# EAGLE design miniPCI_CAN_bus_controller (EAGLE 9.6.2)
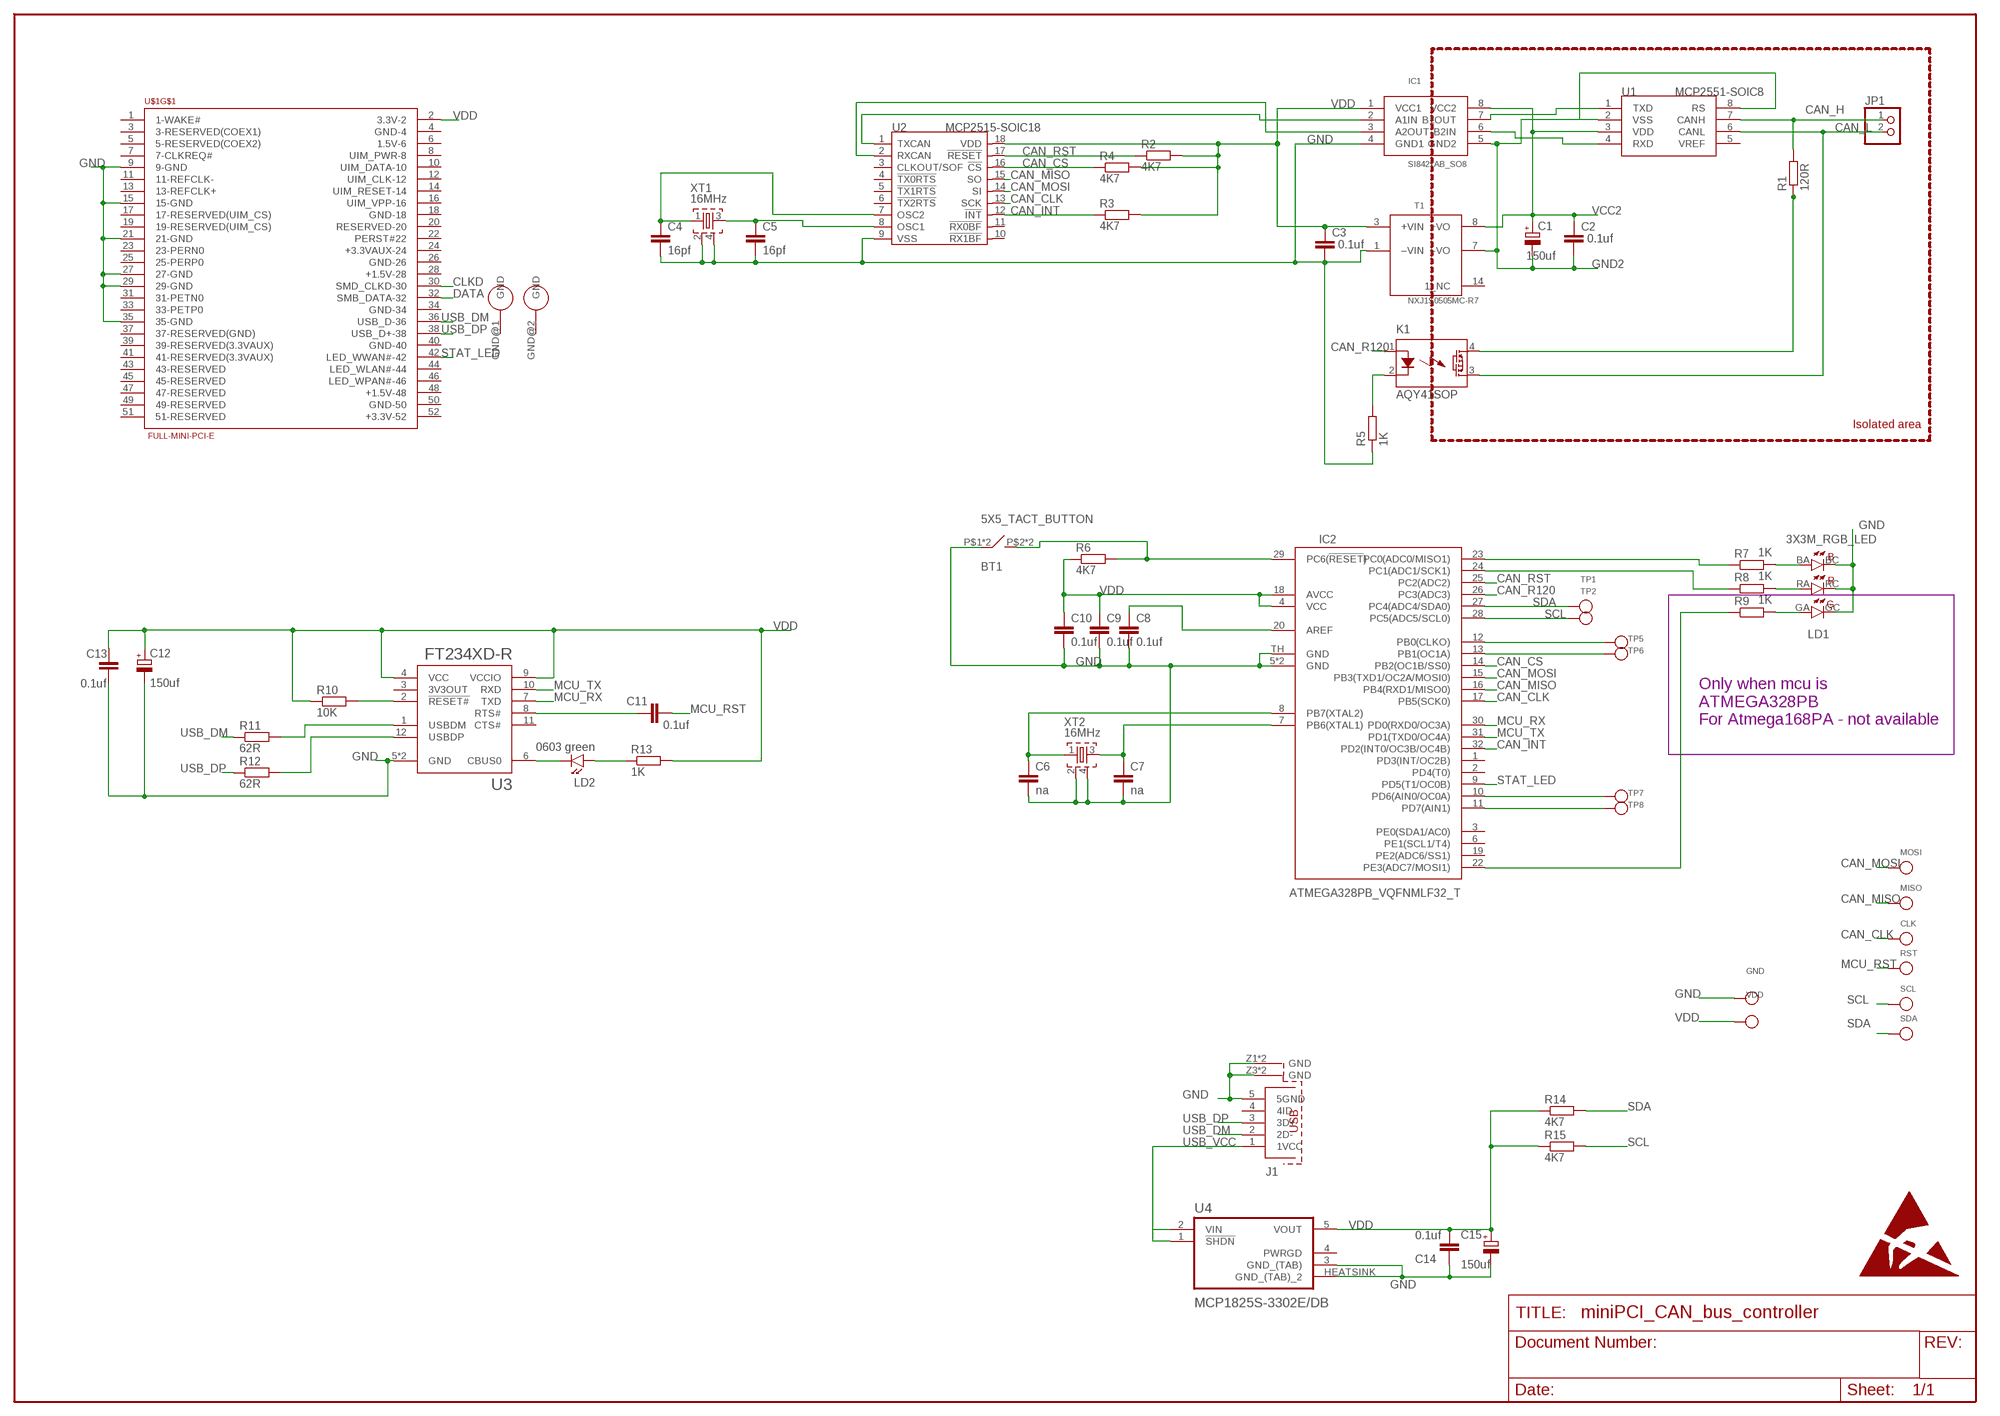
[diagram p0: schematic, sheet 1]

## Parts
BT1  5X5_TACT_BUTTON  5X5_TACT_BUTTONCYCLONE  [5X5MM_SMD_CY]
C1  150uf  TANTAL_150UF_3528  [KA-3528ASYC]
C2  0.1uf  SMD_C0603  [0603]
C3  0.1uf  SMD_C0603  [0603]
C4  16pf  SMD_C0603  [0603]
C5  16pf  SMD_C0603  [0603]
C6  na  SMD_C0603  [0603]
C7  na  SMD_C0603  [0603]
C8  0.1uf  SMD_C0603  [0603]
C9  0.1uf  SMD_C0603  [0603]
C10  0.1uf  SMD_C0603  [0603]
C11  0.1uf  SMD_C0603  [0603]
C12  150uf  TANTAL_150UF_3528  [KA-3528ASYC]
C13  0.1uf  SMD_C0603  [0603]
C14  0.1uf  SMD_C0603  [0603]
C15  150uf  TANTAL_150UF_3528  [KA-3528ASYC]
CLK  TEST_POINT_D2MM  [TP]
GND  TEST_POINT_D2MM  [TP]
IC1  SI8421AB_SO8  [SO8]
IC2  ATMEGA328PB_VQFNMLF32_T  [MLF32-TH]
J1  MINI_USB_TYP_B_@  [65100516121]
JP1  PINHD-1X2  [1X02]
K1  AQY41SOP  [SOP04]
LD1  3X3M_RGB_LED  [3X3MRGB_LED]
LD2  0603 green  LED0603  [0603_P]
MISO  TEST_POINT_D2MM  [TP]
MOSI  TEST_POINT_D2MM  [TP]
R1  120R  SMD_R0603  [0603]
R2  4K7  SMD_R0603  [0603]
R3  4K7  SMD_R0603  [0603]
R4  4K7  SMD_R0603  [0603]
R5  1K  SMD_R0603  [0603]
R6  4K7  SMD_R0603  [0603]
R7  1K  SMD_R0603  [0603]
R8  1K  SMD_R0603  [0603]
R9  1K  SMD_R0603  [0603]
R10  10K  SMD_R0603  [0603]
R11  62R  SMD_R0603  [0603]
R12  62R  SMD_R0603  [0603]
R13  1K  SMD_R0603  [0603]
R14  4K7  SMD_R0603  [0603]
R15  4K7  SMD_R0603  [0603]
RST  TEST_POINT_D2MM  [TP]
SCL  TEST_POINT_D2MM  [TP]
SDA  TEST_POINT_D2MM  [TP]
T1  NXJ1S0505MC-R7  [NXJ1SXXXXMC]
TP1  TEST_POINT_D2MM  [TP]
TP2  TEST_POINT_D2MM  [TP]
TP5  TEST_POINT_D2MM  [TP]
TP6  TEST_POINT_D2MM  [TP]
TP7  TEST_POINT_D2MM  [TP]
TP8  TEST_POINT_D2MM  [TP]
U1  MCP2551-SOIC8  [SO8]
U2  MCP2515-SOIC18  [SO18L]
U3  FT234XD-R  [IC_FT234XD-R]
U4  MCP1825S-3302E/DB  [SOT230P700X180-4N]
U$1  FULL-MINI-PCI-E  [FULL-MINI-PCI-E]
VDD  TEST_POINT_D2MM  [TP]
XT1  16MHz  QUARTZ_ZQ  [QUARTZ_3X3MM]
XT2  16MHz  QUARTZ_ZQ  [QUARTZ_3X3MM]

## Nets
CAN_CLK: CLK.P$1 IC2.17(PB5(SCK0)) U2.13(SCK)
CAN_CS: IC2.14(PB2(OC1B/SS0)) R4.1 U2.16(!CS)
CAN_H: JP1.1 R1.2 U1.7(CANH)
CAN_INT: IC2.32(PD2(INT0/OC3B/OC4B)) R3.1 U2.12(!INT)
CAN_L: JP1.2 K1.3(DS2) U1.6(CANL)
CAN_MISO: IC2.16(PB4(RXD1/MISO0)) MISO.P$1 U2.15(SO)
CAN_MOSI: IC2.15(PB3(TXD1/OC2A/MOSI0)) MOSI.P$1 U2.14(SI)
CAN_R120: IC2.26(PC3(ADC3)) K1.1(A)
CAN_RST: IC2.25(PC2(ADC2)) R2.1 U2.17(!RESET)
CLKD: U$1.30(SMD_CLKD-30)
DATA: U$1.32(SMB_DATA-32)
GND: BT1.P$1 BT1.P$4 C3.2 C4.2 C5.2 C6.2 C7.2 C8.2 C9.2 C10.2 C12.M(-) C13.1 C14.1 C15.M(-) GND.P$1 IC1.4(GND1) IC2.5(GND) IC2.21(GND) IC2.TH(GND) J1.5(5GND) J1.Z1(GND) J1.Z2(GND) J1.Z3(GND) J1.Z4(GND) LD1.BC LD1.GC LD1.RC R5.1 T1.1(–VIN) U2.9(VSS) U3.5(GND) U3.13(GND) U4.3(GND_(TAB)) U4.HEATSINK(GND_(TAB)_2) U$1.9(9-GND) U$1.15(15-GND) U$1.21(21-GND) U$1.27(27-GND) U$1.29(29-GND) U$1.35(35-GND) XT1.2 XT1.4 XT2.2 XT2.4
GND2: C1.M(-) C2.2 IC1.5(GND2) T1.7(–VO) U1.2(VSS) U1.8(RS)
MCU_RST: BT1.P$2 BT1.P$3 C11.2 IC2.29(PC6(!RESET!)) R6.2 RST.P$1
MCU_RX: IC2.30(PD0(RXD0/OC3A)) U3.7(TXD)
MCU_TX: IC2.31(PD1(TXD0/OC4A)) U3.10(RXD)
N$1: R11.2 U3.1(USBDM)
N$2: K1.4(DS1) R1.1
N$3: IC1.2(A1IN) U2.1(TXCAN)
N$4: IC1.7(B1OUT) U1.1(TXD)
N$5: IC1.6(B2IN) U1.4(RXD)
N$6: IC1.3(A2OUT) U2.2(RXCAN)
N$7: C8.1 IC2.20(AREF)
N$8: LD2.1(K) U3.6(CBUS0)
N$9: LD2.2(A) R13.1
N$10: C6.1 IC2.8(PB7(XTAL2)) XT2.1
N$11: C4.1 U2.7(OSC2) XT1.1
N$12: C5.1 U2.8(OSC1) XT1.3
N$13: K1.2(K) R5.2
N$14: C7.1 IC2.7(PB6(XTAL1)) XT2.3
N$15: LD1.BA R7.2
N$16: LD1.RA R8.2
N$17: LD1.GA R9.2
N$18: R12.2 U3.12(USBDP)
N$19: IC2.23(PC0(ADC0/MISO1)) R7.1
N$20: IC2.24(PC1(ADC1/SCK1)) R8.1
N$21: IC2.22(PE3(ADC7/MOSI1)) R9.1
N$22: IC2.10(PD6(AIN0/OC0A)) TP7.P$1
N$23: IC2.11(PD7(AIN1)) TP8.P$1
N$24: C11.1 U3.8(RTS#)
N$25: IC2.13(PB1(OC1A)) TP6.P$1
N$26: IC2.12(PB0(CLKO)) TP5.P$1
N$27: R10.2 U3.2(!RESET#)
SCL: IC2.28(PC5(ADC5/SCL0)) R15.2 SCL.P$1 TP2.P$1
SDA: IC2.27(PC4(ADC4/SDA0)) R14.2 SDA.P$1 TP1.P$1
STAT_LED: IC2.9(PD5(T1/OC0B)) U$1.42(LED_WWAN#-42)
USB_DM: J1.2(2D-) R11.1 U$1.36(USB_D-36)
USB_DP: J1.3(3D+) R12.1 U$1.38(USB_D+-38)
USB_VCC: J1.1(1VCC) U4.1(!SHDN) U4.2(VIN)
VCC2: C1.P(+) C2.1 IC1.8(VCC2) T1.8(+VO) U1.3(VDD)
VDD: C3.1 C9.1 C10.1 C12.P(+) C13.2 C14.2 C15.P(+) IC1.1(VCC1) IC2.4(VCC) IC2.18(AVCC) R2.2 R3.2 R4.2 R6.1 R10.1 R13.2 R14.1 R15.1 T1.3(+VIN) U2.18(VDD) U3.4(VCC) U3.9(VCCIO) U4.5(VOUT) U$1.2(3.3V-2) VDD.P$1
Unconnected: IC2.1(PD3(INT/OC2B)) IC2.2(PD4(T0)) IC2.3(PE0(SDA1/AC0)) IC2.6(PE1(SCL1/T4)) IC2.19(PE2(ADC6/SS1)) J1.4(4ID) T1.14(1_NC) U1.5(VREF) U2.3(CLKOUT/SOF) U2.4(!TX0RTS) U2.5(!TX1RTS) U2.6(!TX2RTS) U2.10(!RX1BF) U2.11(!RX0BF) U3.3(3V3OUT) U3.11(CTS#) U4.4(PWRGD) U$1.1(1-WAKE#) U$1.3(3-RESERVED(COEX1)) U$1.4(GND-4) U$1.5(5-RESERVED(COEX2)) U$1.6(1.5V-6) U$1.7(7-CLKREQ#) U$1.8(UIM_PWR-8) U$1.10(UIM_DATA-10) U$1.11(11-REFCLK-) U$1.12(UIM_CLK-12) U$1.13(13-REFCLK+) U$1.14(UIM_RESET-14) U$1.16(UIM_VPP-16) U$1.17(17-RESERVED(UIM_CS)) U$1.18(GND-18) U$1.19(19-RESERVED(UIM_CS)) U$1.20(RESERVED-20) U$1.22(PERST#22) U$1.23(23-PERN0) U$1.24(+3.3VAUX-24) U$1.25(25-PERP0) U$1.26(GND-26) U$1.28(+1.5V-28) U$1.31(31-PETN0) U$1.33(33-PETP0) U$1.34(GND-34) U$1.37(37-RESERVED(GND)) U$1.39(39-RESERVED(3.3VAUX)) U$1.40(GND-40) U$1.41(41-RESERVED(3.3VAUX)) U$1.43(43-RESERVED) U$1.44(LED_WLAN#-44) U$1.45(45-RESERVED) U$1.46(LED_WPAN#-46) U$1.47(47-RESERVED) U$1.48(+1.5V-48) U$1.49(49-RESERVED) U$1.50(GND-50) U$1.51(51-RESERVED) U$1.52(+3.3V-52)

## Notes on the sheet
- Isolated area
- Only when mcu is
  ATMEGA328PB
  For Atmega168PA - not available

## Power pins joined to a net without a drawn wire
GND: U$1.GND@1(GND) U$1.GND@2(GND)

## Library data of the parts
BT1 = passive_components:5X5_TACT_BUTTON
C1 C12 C15 = passive_components:TANTAL_150UF_3528
C2-C11 C13 C14 = passive_components:SMD_C
CLK GND MISO MOSI RST SCL SDA TP1 TP2 TP5-TP8 VDD = passive_components:TEST_POINT_D2MM
IC1 = my_IC:SI8421AB_SO8
IC2 = my_IC:ATMEGA328PB_VQFN
J1 = passive_components:MINI_USB_TYP_B_@
JP1 = pinhead:PINHD-1X2: PIN HEADER
K1 = relays:AQY*: PhotoMOS Relay NAiS Source: http://www.panasonic-electric-works.com/catalogues/downloads/photomos/ds_x615_en_aqz10_20.pdf; OC_FARNELL: unknown; OC_NEWARK: unknown
LD1 = passive_components:3X3M_RGB_LED
LD2 = passive_components:LED
R1-R15 = passive_components:SMD_R
T1 = Tracopower - TSM 0505S:NXJ1S0505MC-R7: № Mouser:580-NXJ1S0505MC-R7 № произв.: NXJ1S0505MC-R7 Произв.:Murata Power Solutions Номер клиента: Номер клиента Описание: Преобразователи постоянного тока в постоянный с изоляцией 1W 5Vin 5Vout 200mA SM
U1 = my_IC:MCP2551: High-Speed CAN Transceiver http://ww1.microchip.com/downloads/en/devicedoc/21667f.pdf
U2 = my_IC:MCP2515: Stand-Alone CAN Controller With SPI Interface
U3 = my_IC:FT234XD-R: USB Bridge, USB to UART USB 2.0 UART Interface 12-DFN (3x3); AVAILABILITY: Unavailable; DESCRIPTION: USB Bridge, USB to UART USB 2.0 UART Interface 12-DFN (3x3); MF: FTDI,; MP: FT234XD-R; PACKAGE: DFN-12 FTDI; PRICE: None
U4 = my_IC:MCP1825S-3302E/DB; AVAILABILITY: Unavailable; DESCRIPTION: Linear Voltage Regulator IC 1 Output 500mA SOT-223-3; MF: Microchip; MP: MCP1825S-3302E/DB; PACKAGE: SOT-223 Microchip; PRICE: None
U$1 = mini-pci-e:FULL-MINI-PCI-E
XT1 XT2 = passive_components:QUARTZ_ZQ

## Board
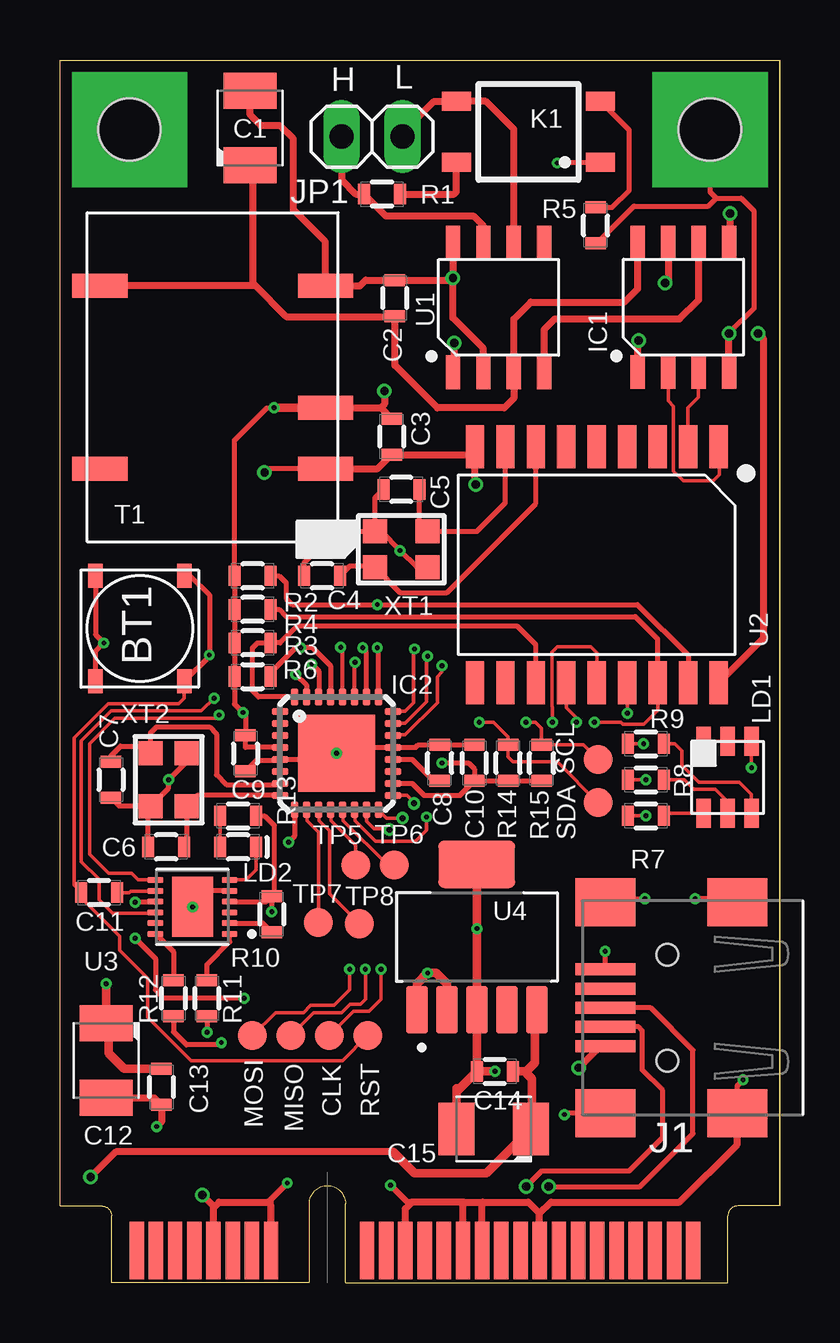
[diagram p1: board, top side]
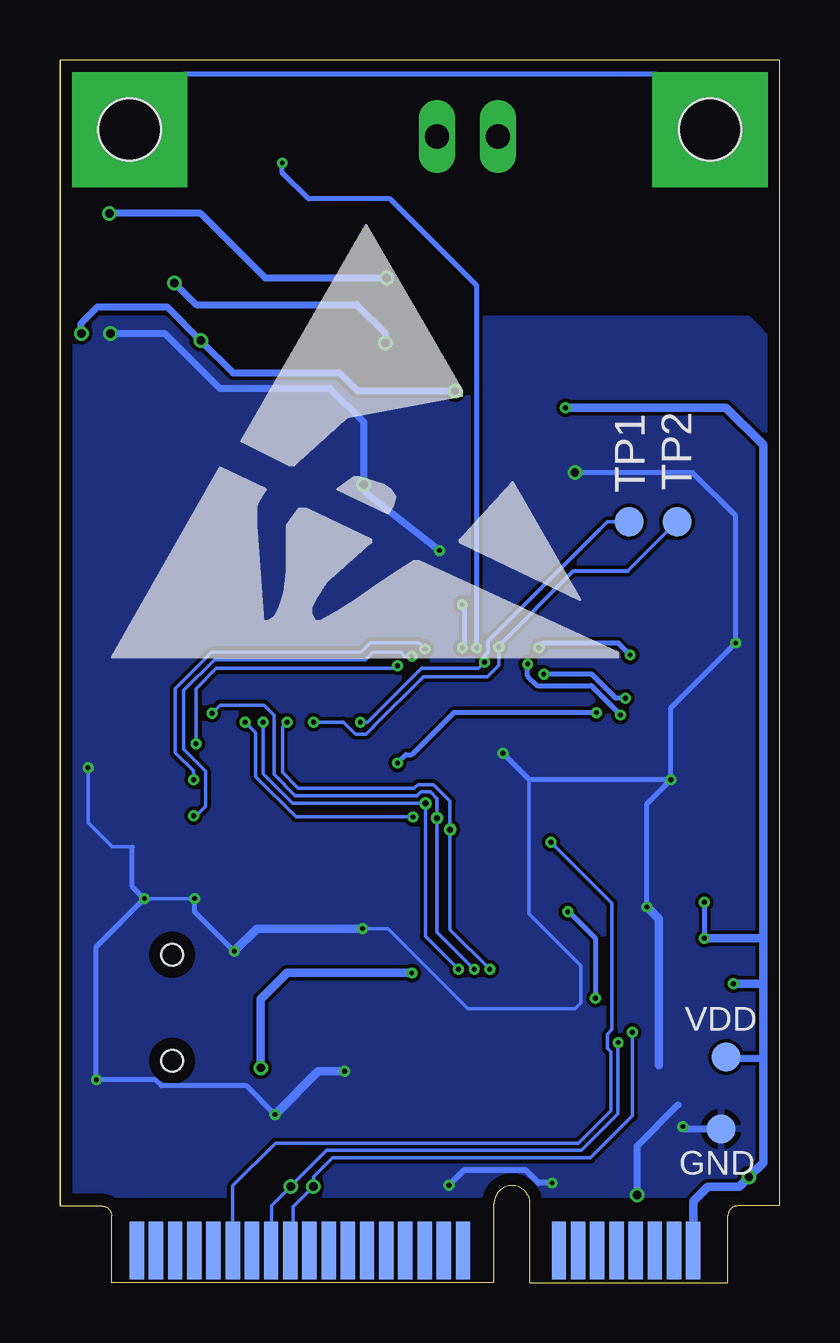
[diagram p2: board, bottom side, seen from below]

Size 30 x 50.95 mm. Coordinates in mm from the lower left corner, seen from the top.
Copper layers (1*16): Top 0.035mm / dielectric 1.5mm / Bottom 0.035mm
Design rules "default *": minimum track width 6mil, minimum drill 0.2mm, track to track 6mil, track to pad 6mil, pad to pad 6mil, via to via 6mil, smd to smd 6mil, copper to edge 20mil, drill to drill 6mil, minimum pad ring 5mil, minimum via ring 5mil, stop-mask expansion 4mil, vias tented up to drill 20mil, thermal gap 10mil

### Footprints (pad centres in the part's own frame; a part is rotated, then mirrored left to right if it is on the bottom)
5X5MM_SMD_CY = smd 1 x 0.6: P$1 -2.2,1.85; P$2 -2.2,-1.85; P$3 2.2,-1.85; P$4 2.2,1.85
KA-3528ASYC = smd 1.5 x 2.2: M -1.55,0; P 1.55,0
0603 = smd 0.85 x 0.5: 1 0,0.75; 2 0,-0.75
TP = smd 1.2 x 1.2: P$1 0,0
SO8 = smd 0.6 x 1.4: 1 -1.905,-2.7; 2 -0.635,-2.7; 3 0.635,-2.7; 4 1.905,-2.7; 5 1.905,2.7; 6 0.635,2.7; 7 -0.635,2.7; 8 -1.905,2.7
MLF32-TH = smd 0.7 x 0.3: 1 -2.35,1.75; 2 -2.35,1.25; 3 -2.35,0.75; 4 -2.35,0.25; 5 -2.35,-0.25; 6 -2.35,-0.75; 7 -2.35,-1.25; 8 -2.35,-1.75; 17 2.35,-1.75; 18 2.35,-1.25; 19 2.35,-0.75; 20 2.35,-0.25; 21 2.35,0.25; 22 2.35,0.75; 23 2.35,1.25; 24 2.35,1.75 | smd 0.3 x 0.7: 9 -1.75,-2.35; 10 -1.25,-2.35; 11 -0.75,-2.35; 12 -0.25,-2.35; 13 0.25,-2.35; 14 0.75,-2.35; 15 1.25,-2.35; 16 1.75,-2.35; 25 1.75,2.35; 26 1.25,2.35; 27 0.75,2.35; 28 0.25,2.35; 29 -0.25,2.35; 30 -0.75,2.35; 31 -1.25,2.35; 32 -1.75,2.35 | smd 3.2 x 3.2: TH 0,0
65100516121 = smd 0.5 x 2.5: 1 -1.6,2.6; 2 -0.8,2.6; 3 0,2.6; 4 0.8,2.6; 5 1.6,2.6 | smd 2 x 2.5: Z1 -4.4,2.6; Z2 4.4,2.6; Z3 4.4,-2.9; Z4 -4.4,-2.9 | hole 0.9: -2.2,0; 2.2,0
1X02 = drill 1.016 long: 1 -1.27,0; 2 1.27,0
SOP04 = smd 0.8 x 1.2: 1 -1.27,-3; 2 1.27,-3; 3 1.27,3; 4 -1.27,3
3X3MRGB_LED = smd 0.6 x 1.2: BA -1,-1.5; BC -1,1.5; GA 1,-1.5; GC 1,1.5; RA 0,-1.5; RC 0,1.5
0603_P = smd 0.85 x 0.5: 1 0,0.75; 2 0,-0.75
NXJ1SXXXXMC = smd 1 x 2.3: 1 -3.81,-4.7; 3 -1.27,-4.7; 7 3.81,-4.7; 8 3.81,4.7; 14 -3.81,4.7
SO18L = smd 0.762 x 1.778: 1 -5.08,-4.915; 2 -3.81,-4.915; 3 -2.54,-4.915; 4 -1.27,-4.915; 5 0,-4.915; 6 1.27,-4.915; 7 2.54,-4.915; 8 3.81,-4.915; 9 5.08,-4.915; 10 5.08,4.915; 11 3.81,4.915; 12 2.54,4.915; 13 1.27,4.915; 14 0,4.915; 15 -1.27,4.915; 16 -2.54,4.915; 17 -3.81,4.915; 18 -5.08,4.915
IC_FT234XD-R = smd 0.65 x 0.25: 1 -1.55,1.125; 2 -1.55,0.675; 3 -1.55,0.225; 4 -1.55,-0.225; 5 -1.55,-0.675; 6 -1.55,-1.125; 7 1.55,-1.125; 8 1.55,-0.675; 9 1.55,-0.225; 10 1.55,0.225; 11 1.55,0.675; 12 1.55,1.125 | smd 1.7 x 2.5: 13 0,0
SOT230P700X180-4N = smd 1.97 x 0.89: 1 -3.025,2.5; 2 -3.025,1.25; 3 -3.025,0; 4 -3.025,-1.25; 5 -3.025,-2.5 | smd 1.97 x 3.19: HEATSINK 3.025,0
FULL-MINI-PCI-E = smd 0.6 x 2.4: 1 -7.95,1.45; 3 -7.15,1.45; 5 -6.35,1.45; 7 -5.55,1.45; 9 -4.75,1.45; 11 -3.95,1.45; 13 -3.15,1.45; 15 -2.35,1.45; 17 1.65,1.45; 19 2.45,1.45; 21 3.25,1.45; 23 4.05,1.45; 25 4.85,1.45; 27 5.65,1.45; 29 6.45,1.45; 31 7.25,1.45; 33 8.05,1.45; 35 8.85,1.45; 37 9.65,1.45; 39 10.45,1.45; 41 11.25,1.45; 43 12.05,1.45; 45 12.85,1.45; 47 13.65,1.45; 49 14.45,1.45; 51 15.25,1.45 | smd 0.6 x 2.4 bottom: 2 -7.55,1.45; 4 -6.75,1.45; 6 -5.95,1.45; 8 -5.15,1.45; 10 -4.35,1.45; 12 -3.55,1.45; 14 -2.75,1.45; 16 -1.95,1.45; 18 2.05,1.45; 20 2.85,1.45; 22 3.65,1.45; 24 4.45,1.45; 26 5.25,1.45; 28 6.05,1.45; 30 6.85,1.45; 32 7.65,1.45; 34 8.45,1.45; 36 9.25,1.45; 38 10.05,1.45; 40 10.85,1.45; 42 11.65,1.45; 44 12.45,1.45; 46 13.25,1.45; 48 14.05,1.45; 50 14.85,1.45; 52 15.65,1.45 | drill 2.6 pad 4.8 square: GND@1 -8.25,48.15; GND@2 15.95,48.15 | hole 2.6: -8.25,48.15; 15.95,48.15
QUARTZ_3X3MM = smd 1 x 1: 1 -0.75,1.1; 2 0.75,1.1; 3 0.75,-1.1; 4 -0.75,-1.1

### Placement (x,y rotation side)
BT1  3.33,27.26 90 top
C1  7.93,48.12 270 top
C2  13.96,41.03 180 top
C3  13.83,35.26 0 top
C4  10.93,29.46 270 top
C5  14.23,33.06 270 top
C6  4.43,18.16 270 top
C7  2.13,20.96 0 top
C8  15.83,21.66 180 top
C9  7.73,22.06 0 top
C10  17.28,21.66 180 top
C11  1.63,16.26 270 top
C12  1.93,9.26 90 top
C13  4.23,8.16 180 top
C14  18.13,8.81 90 top
C15  18.08,6.41 0 top
CLK  11.23,10.31 0 top
GND  2.43,6.41 0 bottom
IC1  25.99,40.65 0 top
IC2  11.53,22.06 0 top
J1  25.33,11.46 90 top
JP1  13.01,47.76 0 top
K1  19.53,47.96 90 top
LD1  27.83,21.06 0 top
LD2  7.43,18.16 270 top
MISO  9.63,10.31 0 top
MOSI  8.03,10.31 0 top
R1  13.43,45.36 270 top
R2  8.03,29.46 270 top
R3  8.03,26.66 270 top
R4  8.03,28.06 270 top
R5  22.33,44.06 180 top
R6  8.03,25.26 90 top
R7  24.43,19.46 90 top
R8  24.43,20.96 90 top
R9  24.43,22.46 90 top
R10  8.83,15.36 0 top
R11  6.13,11.86 180 top
R12  4.73,11.86 180 top
R13  7.43,19.46 90 top
R14  18.68,21.66 180 top
R15  20.08,21.66 180 top
RST  12.83,10.31 0 top
SCL  22.43,21.81 180 top
SDA  22.43,20.01 270 top
T1  6.37,37.73 90 top
TP1  6.28,31.71 0 bottom
TP2  4.28,31.71 0 bottom
TP5  12.33,17.41 0 top
TP6  13.93,17.41 0 top
TP7  10.78,15.01 0 top
TP8  12.48,14.96 0 top
U1  18.29,40.64 0 top
U2  22.38,29.92 180 top
U3  5.53,15.66 180 top
U4  17.38,14.41 90 top
U$1  11.15,-0.1 0 top
U$2  [ESD]  28.03,25.86 0 bottom
VDD  2.23,9.41 0 bottom
XT1  14.23,30.56 90 top
XT2  4.53,20.96 180 top

### Tracks (layer width: path | path; a pad name or v marks a point on that pad's centre or on a via)
CAN_CLK  (via drill 0.2 pad 0.35, 0.25)
  Top 0.152: IC2.17 14.47,20.31 14.75,20.02 v14.75,19.97
  Top 0.153: U2.13 21.11,23.96 21.53,23.54 v21.53,23.36 | CLK.P$1 12.23,11.31 12.88,11.31 13.38,11.81 v13.38,13.06
  Bottom 0.153: v21.53,23.36 21.53,21.21 20.29,19.97 v14.75,19.97 14.75,19.57 14.76,19.57 14.76,14.44 v13.38,13.06
CAN_CS  (via drill 0.2 pad 0.35)
  Top 0.153: IC2.14 12.3,19.69 12.3,19.26 13.16,18.4 14.82,18.4 15.28,18.86 v15.28,19.41 | 24.93,25 U2.16 | U2.16 | v22.28,23.36 23.38,23.36 23.47,23.28 24.35,23.28 24.92,23.85 U2.16
  Top 0.2: U2.16 24.92,26.82 23.98,27.76 9.43,27.76 9.13,28.06 R4.1 8.83,28.01
  Bottom 0.153: v22.28,23.36 21.83,22.92 21.83,21.08 20.16,19.41 v15.28,19.41
CAN_H
  Top 0.3: JP1.1 11.74,45.95 12.33,45.36 R1.2 13.58,44.46 17.23,44.46 17.65,44.03 U1.7
CAN_INT
  Top 0.2: U2.12 19.84,26.6 19.08,27.36 9.87,27.36 9.18,26.66 R3.1 8.23,26.66 8.03,26.46 8.03,24.66 8.28,24.41 IC2.32
CAN_L
  Top 0.3: JP1.2 14.28,47.91 15.6,49.23 K1.3 17.76,49.23 18.92,48.06 U1.6
CAN_MISO  (via drill 0.2 pad 0.35, 0.25)
  Top 0.153: IC2.16 13.62,19.37 v14.28,19.37 | 10.03,10.71 MISO.P$1 10.58,11.26 11.75,11.26 12.1,11.61 12.53,11.61 12.73,11.81 v12.73,13.06 | v23.65,23.74 23.65,25.11
  Top 0.2: 23.65,25.74 23.65,25.11 U2.15
  Bottom 0.153: v23.65,23.74 23.32,24.07 21.49,24.07 21.07,23.65 21.07,21.19 20.19,20.3 15.11,20.3 14.95,20.45 14.56,20.45 14.27,20.17 14.27,19.77 14.28,19.77 v14.28,19.37 14.28,14.61 v12.73,13.06
CAN_MOSI  (via drill 0.2 pad 0.35, 0.25)
  Top 0.153: IC2.15 12.78,19.23 13.1,18.91 13.7,18.91 v13.73,18.89 | 8.03,10.76 MOSI.P$1 8.98,11.26 10.15,11.26 10.45,11.57 11.43,11.57 12.08,12.21 v12.08,13.06 | v20.53,23.36 20.53,23.99 20.5,24.02 20.5,26.28 20.73,26.51 22.13,26.51 22.38,26.26 U2.14
  Top 0.2: IC2.15 12.78,19.4
  Bottom 0.153: v20.53,23.36 20.72,23.17 20.72,21.27 20.07,20.61 15.23,20.61 15.08,20.76 14.43,20.76 13.73,20.06 v13.73,18.89 13.73,14.71 v12.08,13.06
CAN_R120  (via drill 0.2 pad 0.12)
  Top 0.2: IC2.26 12.78,26.23 12.75,26.26 12.75,26.33 v12.62,26.46 | v20.73,46.66 20.76,46.69 K1.1
  Bottom 0.2: v12.62,26.46 12.62,41.55 16.23,45.16 19.63,45.16 20.73,46.26 v20.73,46.66
CAN_RST  (via drill 0.2 pad 0.12)
  Top 0.2: R2.1 9.13,29.46 9.43,29.16 9.43,28.51 9.68,28.26 v13.23,28.26 24.08,28.26 26.19,26.15 U2.17 | IC2.25 13.28,26.41 v13.23,26.46
  Bottom 0.2: v13.23,28.26 13.13,28.16 13.13,26.56 v13.23,26.46
GND  (via drill 0.2, 0.2 pad 0.12, 0.2 pad 0.35, 0.35, 0.35 pad 0.12)
  Top 0.152: v28.83,21.46 LD1.GC LD1.RC LD1.BC
  Top 0.153: IC2.TH 12.73,22.06 12.98,22.31
  Top 0.2: C4.2 10.18,30.01 11.48,31.31 XT1.2 13.13,32.71 C5.2 | 13.38,31.31 v14.18,30.51 14.88,29.81 XT1.4 | R5.1 22.38,43.31 23.93,44.86 27.03,44.86 27.36,45.19 | 27.36,45.19 28.4,45.19 28.93,44.66 28.93,40.59 v27.89,39.56 | U$1.GND@2 27.1,45.45 27.36,45.19 | C7.2 2.48,19.86 XT2.2 | C6.2 3.68,19.76 XT2.2 | IC2.TH 11.28,21.81 IC2.5 9.13,21.76 8.18,21.76 C9.2 | 12.98,22.31 IC2.21 14.83,22.31 14.93,22.41 C8.2 C10.2 | XT2.4 5.28,21.71 v4.53,20.96 4.53,20.61 XT2.2 | T1.1 8.69,33.92 v8.53,33.76 | BT1.P$1 1.48,26.31 v1.83,26.66 1.48,27.01 BT1.P$4 | U3.5 6.25,16.34 6.23,16.36 U3.13 | 26.58,15.91 v26.48,16.01 28.08,16.01 J1.Z3 | J1.Z2 22.88,16.01 v24.38,16.01 | J1.Z4 28.23,8.21 v28.48,8.46 | J1.Z1 21.08,7.06 v21.03,7.01 | J1.5 v22.73,13.81
  Top 0.25: 8.8,3.23 8.8,3.48 v9.48,4.16 | 14.67,3.36 14.48,3.36 v13.78,4.06
  Top 0.3: IC1.4 v27.89,39.56 | v17.33,33.26 17.3,33.29 17.3,34.76 | 17.3,34.76 U2.9 | T1.1 13.24,33.92 C3.2 17.05,34.51 17.3,34.76 | XT1.2 13.38,31.31 | U$1.15 8.8,3.23 8.67,3.36 6.63,3.36 6.4,3.13 | U$1.21 14.4,3.09 14.67,3.36 16.83,3.36 | U$1.35 20,2.89 | 16.83,3.36 17.63,3.36 | 17.63,3.36 19.53,3.36 20,2.89 | U$1.29 17.6,3.33 17.63,3.36 | U$1.27 16.8,3.33 16.83,3.36 | 20,2.89 20.47,3.36 25.83,3.36 28.23,5.76 J1.Z4 | U$1.9 6.4,3.13 | 6.4,3.13 6.4,3.19 v5.93,3.66 | C12.M 3.93,7.71 C13.1 4.23,6.71 v4.03,6.51
  Top 0.35: U4.HEATSINK v17.38,14.76 U4.3 C14.1 | C15.M 16.53,7.96 | 16.53,7.96 C14.1 | 16.53,7.96 16.53,8.11 | v18.13,8.81 C14.1
  Bottom 0.152: v28.83,21.46 28.83,19.16 27.83,18.16 26.98,18.16
  Bottom 0.153: v26.48,16.01 v24.38,16.01 | v17.38,14.76 16.33,14.76 12.98,11.41 8.53,11.41 8.28,11.66 8.28,13.21 10.45,15.39 10.45,20.99
  Bottom 0.2: U$1.GND@1 5.21,50.36 24.79,50.36 U$1.GND@2 | v4.53,20.96 10.43,20.96 10.45,20.99 IC2.TH | v4.53,20.96 4.53,23.96 v1.83,26.66 1.83,31.96 3.63,33.76 v8.53,33.76 | U3.13 5.53,19.96 v4.53,20.96 | 24.43,16.06 v24.38,16.01 24.38,15.46 v22.73,13.81 | 26.98,18.16 26.98,16.51 v26.48,16.01 28.48,14.01 v28.48,8.46 26.03,8.46 25.77,8.2 22.22,8.2 v21.03,7.01
  Bottom 0.25: v9.48,4.16 10.05,4.16 10.57,4.68 13.16,4.68 v13.78,4.06
  Bottom 0.3: v27.89,39.56 25.63,39.56 23.33,37.26 18.73,37.26 17.33,35.86 v17.33,33.26 17.23,33.36 17.23,32.9 v14.18,30.51 | v5.93,3.66 5.93,5.71 C13.1 | 2.58,6.41 GND.P$1 3.93,6.41 v4.03,6.51
  Bottom 0.35: U3.13 5.03,15.16 5.03,9.06 | v17.38,14.76 21.78,14.76 v22.73,13.81 | v21.03,7.01 19.23,8.81 v18.13,8.81
  other vias: 11.53,22.06 5.53,15.66
  pour Bottom: 30.03,40.16 1.33,40.16 0.23,39.06 0.23,4.76 1.33,3.66 30.03,3.66
GND2  (via drill 0.35)
  Top 0.3: U1.2 17.65,38.94 16.38,40.2 v16.38,41.86 | U1.8 v16.38,41.86 | v27.93,44.56 27.93,43.39 IC1.5 | v16.38,41.86 16.3,41.78 C2.2 12.75,41.78 12.51,41.54 T1.7 11.07,43.37 9.73,44.71 9.73,47.66 9.18,48.21 8.38,48.21 7.93,48.66 C1.M
  Bottom 0.3: v16.38,41.86 21.43,41.86 24.13,44.56 v27.93,44.56
MCU_RST  (via drill 0.2 pad 0.12)
  Top 0.153: RST.P$1 11.78,9.26 5.46,9.26 3.65,11.07 3.65,12.69 2.48,13.86 2.48,14.45 1.05,15.87 1.05,16.09 C11.2 0.58,16.55 0.58,22.71 2.01,24.13 4.95,24.13 5.18,24.36 BT1.P$2
  Top 0.2: R6.2 8.78,25.41 9.83,26.46 v10.03,26.46 10.53,26.46 11.28,25.71 IC2.29 | BT1.P$2 6.23,26.11 v6.23,26.16 6.23,28.66 5.43,29.46 BT1.P$3
  Bottom 0.2: v6.23,26.16 6.73,26.66 9.88,26.66 10.03,26.51 v10.03,26.46
MCU_RX  (via drill 0.2 pad 0.12)
  Top 0.153: v6.63,23.66 6.49,23.52 2.29,23.52 1.23,22.46 1.23,17.86 2.03,17.06 2.98,17.06 3.25,16.79 U3.7
  Top 0.2: IC2.30 10.8,24.43 10.8,25.48 v10.5,25.78
  Bottom 0.2: v6.63,23.66 7.85,24.88 10.1,24.88 10.5,25.28 v10.5,25.78
MCU_TX  (via drill 0.2 pad 0.12)
  Top 0.153: v6.43,24.36 5.9,23.83 2.13,23.83 0.89,22.58 0.89,17.55 1.63,16.81 1.63,15.96 2.19,15.4 3.94,15.4 U3.10
  Top 0.2: v9.83,25.36 10.28,24.91 IC2.31
  Bottom 0.2: v6.43,24.36 6.83,24.36 7.83,25.36 v9.83,25.36
N$1
  Top 0.2: U3.1 7.08,14.21 6.13,13.26 R11.2
N$2
  Top 0.3: R1.1 16.43,45.36 16.53,45.46 K1.4
N$3
  Top 0.153: IC1.2 25.35,36.74 25.58,36.52 25.58,33.81 25.98,33.41 27.23,33.41 27.48,33.66 27.48,34.99 27.46,35.01
  Top 0.3: 27.46,35.43 27.46,35.01 U2.1
N$4  (via drill 0.35)
  Top 0.3: IC1.7 25.35,41.78 v25.23,41.66 | v16.43,39.16 16.43,37.98 U1.1
  Bottom 0.3: 24.93,41.36 v25.23,41.66 24.33,40.76 17.63,40.76 16.43,39.56 v16.43,39.16
N$5
  Top 0.3: U1.4 20.19,39.72 20.63,40.16 25.83,40.16 26.63,40.96 IC1.6
N$6
  Top 0.153: IC1.3 26.62,36.91 26.18,36.46 26.18,34.84 U2.2
N$7
  Top 0.2: IC2.20 14.68,21.81 15.58,20.91 C8.1
N$8
  Top 0.152: U3.6 7.75,16.79 8.18,17.21 LD2.1
N$9
  Top 0.152: LD2.2 R13.1
N$10
  Top 0.2: C6.1 5.28,18.26 XT2.1 5.73,20.31 IC2.8
N$11
  Top 0.2: C4.1 12.08,29.86 13.08,29.86 XT1.1 14.18,28.76 16.13,28.76 19.84,32.47 19.84,33.97
  Top 0.3: 19.84,33.97 U2.7
N$12
  Top 0.2: C5.1 14.98,31.66 XT1.3 17.38,31.31 18.57,32.5 U2.8
  Top 0.3: 15.18,31.46 XT1.3
N$13
  Top 0.2: R5.2 23.03,44.81 23.73,45.51 23.73,48.03 K1.2
N$14
  Top 0.2: 3.58,22.26 XT2.3 | 3.78,21.96 XT2.3 | XT2.3 3.78,22.26 | 3.78,22.26 3.78,22.91 4.03,23.16 6.23,23.16 6.53,22.86 6.53,21.16 6.93,20.76 9.13,20.76 IC2.7 | C7.1 2.13,21.96 2.53,22.36 3.68,22.36 3.78,22.26
N$15
  Top 0.152: R7.2 25.28,19.56 LD1.BA
N$16
  Top 0.152: R8.2 26.03,20.96 26.43,20.56 27.33,20.56 27.83,20.06 LD1.RA
N$17
  Top 0.152: R9.2 25.63,22.46 25.93,22.16 25.93,21.56 26.62,20.86 28.06,20.86 28.33,20.86 28.83,20.36 LD1.GA
N$18
  Top 0.2: U3.12 4.73,13.79 R12.2
N$19  (via drill 0.2 pad 0.12)
  Top 0.152: IC2.23 14.38,23.31 15.28,24.21 15.28,26.06 v15.33,26.11 | R7.1 v24.43,19.46
  Bottom 0.152: v15.33,26.11 15.64,26.11 15.79,26.27 16.97,26.27 17.27,25.96 23.56,25.96 24.84,24.68 24.84,22.91 | 24.84,22.22 23.93,21.32 23.93,19.86 24.33,19.46 v24.43,19.46
  Bottom 0.153: 24.84,22.91 24.84,22.22
N$20  (via drill 0.2 pad 0.12)
  Top 0.152: IC2.24 14.38,23.81 14.73,24.16 14.73,26.36 v14.78,26.41 | R8.1 v24.43,20.96
  Bottom 0.152: v14.78,26.41 15.04,26.67 17.04,26.67 17.45,26.27 23.68,26.27 25.19,24.76 25.19,22.1 24.43,21.33 v24.43,20.96
N$21  (via drill 0.2, 0.2 pad 0.12)
  Top 0.152: R9.1 v24.33,22.46 | IC2.22 13.9,22.83 14.38,22.83 15.73,24.18 15.73,25.26 15.93,25.46 v15.93,25.71
  Bottom 0.152: v15.93,25.71 16.03,25.61 23.48,25.61 24.33,24.76 v24.33,22.46
N$22
  Top 0.153: IC2.10 10.3,19.69 10.3,19.26 10.78,18.78 TP7.P$1
N$23
  Top 0.153: IC2.11 10.8,19.69 10.8,19.26 11.23,18.83 11.23,16.21 TP8.P$1
N$24
  Top 0.153: C11.1 2.89,16.26 2.94,16.31 3.96,16.31 U3.8
N$25
  Top 0.153: IC2.13 11.8,19.69 11.8,19.26 13.65,17.41 TP6.P$1
N$26
  Top 0.153: IC2.12 11.3,19.69 11.3,19.26 12.33,18.23 TP5.P$1
N$27
  Top 0.2: U3.2 8.45,14.98 R10.2
SCL  (via drill 0.2, 0.2 pad 0.35)
  Top 0.153: v19.43,23.36 19.83,23.36 20.08,23.11 R15.2 21.83,22.41 SCL.P$1
  Top 0.16: IC2.28 11.78,26.4 v11.7,26.48
  Bottom 0.153: 6.33,29.66 TP2.P$1 | v11.7,26.48 11.7,25.74 12.18,25.26 14.85,25.26 16.92,23.19 16.92,23.17 17.23,22.86 17.68,22.86 18.18,23.36 v19.43,23.36
  Bottom 0.16: v11.7,26.48 11.7,26.54 8.59,29.66 6.33,29.66
SDA  (via drill 0.2, 0.2 pad 0.35)
  Top 0.153: R14.2 18.73,22.46 | v17.48,23.36 18.08,23.36 18.68,22.76 R14.2 | R14.2 18.68,21.91 18.88,21.71 20.73,21.71 SDA.P$1
  Top 0.16: IC2.27 12.28,25.84 v12.3,25.86
  Bottom 0.153: 7.53,31.36 7.18,31.71 TP1.P$1 | v12.3,25.86 12.55,25.61 14.93,25.61 17.18,23.36 v17.48,23.36
  Bottom 0.16: v12.3,25.86 12.3,26.13 12.16,26.27 12.16,26.73 7.53,31.36
STAT_LED  (via drill 0.2 pad 0.12)
  Top 0.2: 9.78,19.56 9.78,19.57 IC2.9 9.78,18.61 v9.53,18.36
  Bottom 0.153: U$1.42 22.8,4.04 21.02,5.82 8.38,5.82 7.03,7.17 7.03,9.62 7.19,9.77 7.19,10.35 6.98,10.56 6.98,15.81 v9.53,18.36
USB_DM  (via drill 0.2 pad 0.12, 0.35 pad 0.12)
  Top 0.2: R11.1 v6.13,10.44 | v19.44,4.02 19.45,4.02 20.1,4.66 23.73,4.66 25.13,6.06 25.13,8.01 24.28,8.86 24.28,10.51 24.13,10.66 J1.2
  Bottom 0.153: v6.13,10.44 6.13,6.96 7.88,5.21 18.64,5.21 19.44,4.42 v19.44,4.02 20.28,3.17 20.28,1.47 U$1.36
USB_DP  (via drill 0.2 pad 0.12, 0.35 pad 0.12)
  Top 0.2: R12.1 4.73,10.46 5.28,9.91 6.63,9.91 v6.73,10.01 | v20.38,4.01 24.18,4.01 26.39,6.22 26.39,9.7 24.63,11.46 J1.3
  Bottom 0.153: v6.73,10.01 6.73,7.04 8.26,5.52 18.89,5.52 20.38,4.02 v20.38,4.01 21.18,3.21 21.18,1.37 U$1.38
USB_VCC  (via drill 0.2, 0.35 pad 0.12)
  Top 0.3: v21.63,8.96 22.53,9.86 J1.1
  Top 0.35: U4.1 14.88,12.46 v15.33,12.91 15.68,12.91 16.13,12.46 U4.2
  Bottom 0.3: 21.63,9.46 v21.63,8.96
  Bottom 0.35: v15.33,12.91 20.53,12.91 21.63,11.81 v21.63,8.96
VCC2
  Top 0.3: C1.P 8.05,46.69 8.05,41.64 8.13,41.56 | IC1.8 24.08,41.42 23.53,40.86 19.63,40.86 18.92,40.16 U1.3 18.92,36.86 18.53,36.46 15.73,36.46 13.96,38.23 C2.1 13.94,40.26 9.43,40.26 8.13,41.56 | T1.8 1.69,41.56 8.13,41.56
VDD  (via drill 0.2 pad 0.12, 0.2 pad 0.35, 0.35, 0.35 pad 0.12)
  Top 0.153: 20.03,20.96 R15.1
  Top 0.2: IC2.4 7.73,22.31 C9.1 7.73,23.66 v7.63,23.76 7.28,24.11 R6.1 R3.2 R4.2 R2.2 7.28,35.11 8.63,36.46 v8.93,36.46 | U3.4 8.6,15.89 R10.1 | U3.9 3.95,15.86 v3.13,15.86 | v3.13,14.36 3.98,13.51 3.98,12.21 4.33,11.86 v7.68,11.86 | R13.2 8.53,19.46 8.93,19.06 8.93,16.21 R10.1 | R10.1 v8.83,15.46 | C10.1 R14.1 R15.1 | IC2.18 14.68,20.81 15.18,20.31 16.68,20.31 C10.1 | v15.93,21.66 17.03,21.66 17.28,21.41 C10.1
  Top 0.3: 12.13,36.46 T1.3 13.38,36.46 | IC1.1 24.08,39.22 v24.13,39.26 | U2.18 29.33,26.88 29.33,39.33 v29.11,39.56 | 13.38,36.46 C3.1 | v13.53,37.16 13.53,36.61 13.38,36.46 | U4.5 19.8,11.39 | v1.28,4.41 2.33,5.46 13.88,5.46
  Top 0.35: T1.3 v8.93,36.46 | v1.93,12.46 C12.P 2.03,10.71 2.03,9.56 2.68,8.91 C13.2 | 19.8,11.39 19.8,9.16 19.45,8.81 | 19.45,8.81 C14.2 | 19.45,8.81 19.45,8.73 19.68,8.51 19.68,6.46 C15.P 17.78,4.56 14.78,4.56 13.88,5.46
  Bottom 0.2: v3.13,15.86 v3.13,14.36 | v7.68,11.86 7.68,14.36 8.78,15.46 v8.83,15.46 | v7.63,23.76 13.58,23.76 15.33,22.01 15.58,22.01 v15.93,21.66
  Bottom 0.3: v29.11,39.56 29.11,39.98 28.43,40.66 25.53,40.66 v24.13,39.26 22.78,37.91 18.34,37.91 17.59,37.16 v13.53,37.16 | VDD.P$1 2.18,9.36 0.68,9.36
  Bottom 0.35: v8.93,36.46 2.23,36.46 0.68,34.91 0.68,14.26 | 0.68,14.26 0.68,12.46 | v3.13,14.36 0.78,14.36 0.68,14.26 | v1.93,12.46 0.68,12.46 | U$1.2 3.6,3.39 2.98,4.01 1.68,4.01 v1.28,4.41 0.68,5.01 0.68,9.36 0.68,12.46

### Text on the board
tNames: H | L